# Altium schematic sheet GT_4SBalancer.SchDoc
size A
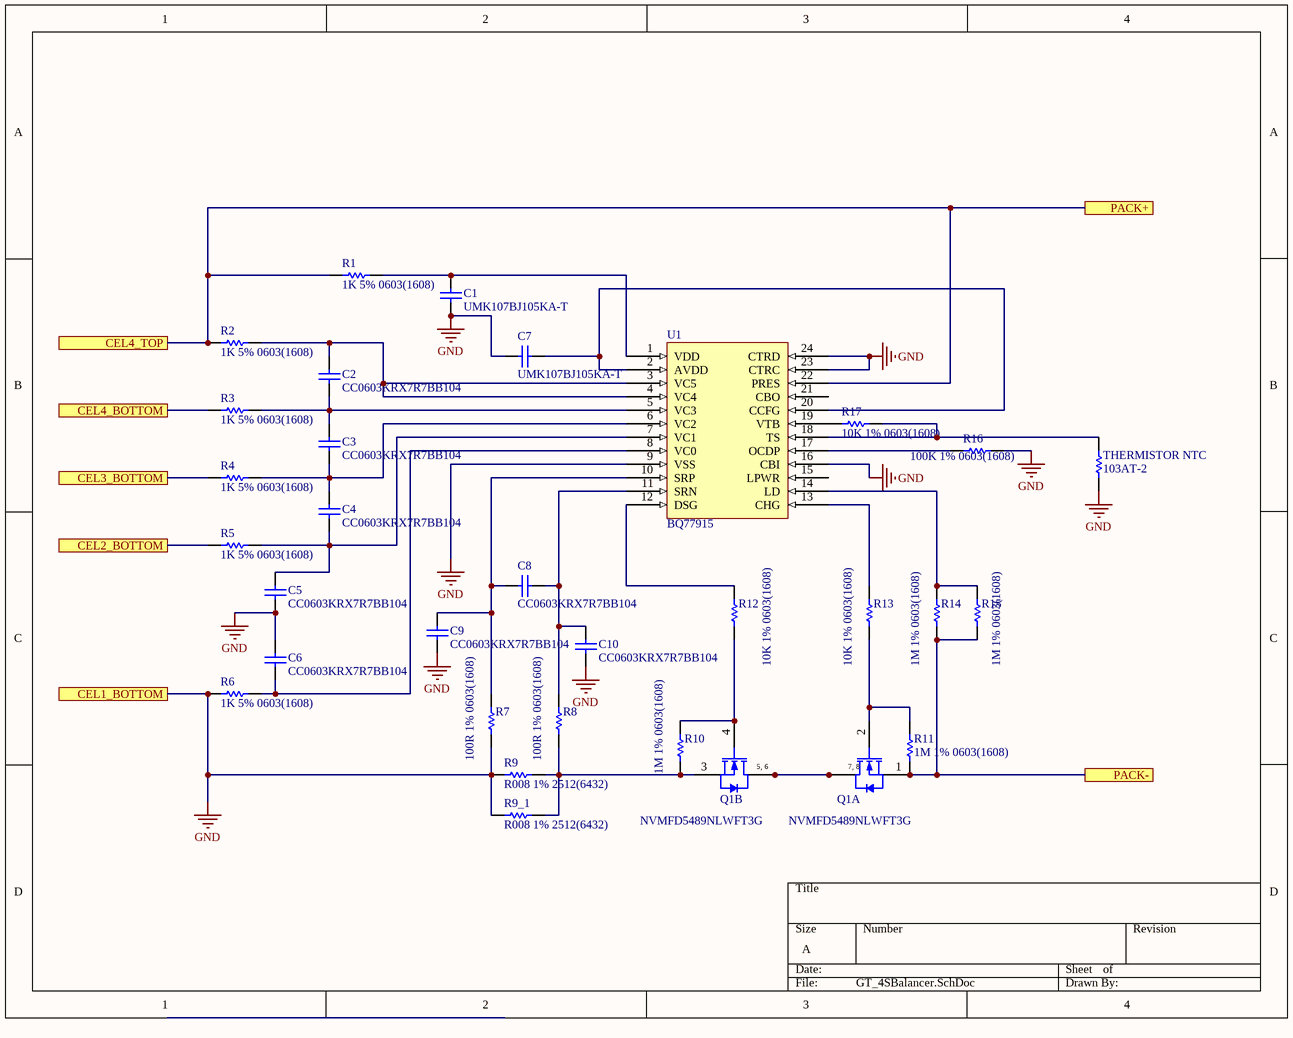
[diagram p0: GT_4SBalancer.SchDoc]

## Parts
C1  UMK107BJ105KA-T  [CAPC1608X90X35ML10T25]
C2  CC0603KRX7R7BB104  [CAPC1608X90X40ML10T20]
C3  CC0603KRX7R7BB104  [CAPC1608X90X40ML10T20]
C4  CC0603KRX7R7BB104  [CAPC1608X90X40ML10T20]
C5  CC0603KRX7R7BB104  [CAPC1608X90X40ML10T20]
C6  CC0603KRX7R7BB104  [CAPC1608X90X40ML10T20]
C7  UMK107BJ105KA-T  [CAPC1608X90X35ML10T25]
C8  CC0603KRX7R7BB104  [CAPC1608X90X40ML10T20]
C9  CC0603KRX7R7BB104  [CAPC1608X90X40ML10T20]
C10  CC0603KRX7R7BB104  [CAPC1608X90X40ML10T20]
Q1  NVMFD5489NLWFT3G  [ONSC-DFN-8-506BT_V]  (parts A,B of 2)
R1  1K 5% 0603(1608)  [RESC0603(1608)_L]
R2  1K 5% 0603(1608)  [RESC0603(1608)_L]
R3  1K 5% 0603(1608)  [RESC0603(1608)_L]
R4  1K 5% 0603(1608)  [RESC0603(1608)_L]
R5  1K 5% 0603(1608)  [RESC0603(1608)_L]
R6  1K 5% 0603(1608)  [RESC0603(1608)_L]
R7  100R 1% 0603(1608)  [RESC0603(1608)_M]
R8  100R 1% 0603(1608)  [RESC0603(1608)_M]
R9  R008 1% 2512(6432)  [RESC2512(6432)_L]
R9_1  R008 1% 2512(6432)  [RESC2512(6432)_L]
R10  1M 1% 0603(1608)  [RESC0603(1608)_L]
R11  1M 1% 0603(1608)  [RESC0603(1608)_L]
R12  10K 1% 0603(1608)  [RESC0603(1608)_N]
R13  10K 1% 0603(1608)  [RESC0603(1608)_N]
R14  1M 1% 0603(1608)  [RESC0603(1608)_L]
R15  1M 1% 0603(1608)  [RESC0603(1608)_L]
R16  100K 1% 0603(1608)  [RESC0603(1608)_N]
R17  10K 1% 0603(1608)  [RESC0603(1608)_N]
THERMISTOR_NTC  103AT-2  [SEMI-103AT-2_V]
U1  BQ77915  [BQ77915]

## Ports
CEL1_BOTTOM, CEL2_BOTTOM, CEL3_BOTTOM, CEL4_BOTTOM, CEL4_TOP, PACK+, PACK-

## Nets
GND: C1.1 C5.1 C6.2 C7.1 C9.1 C10.1 R6.1 R7.1 R9.1 R9_1.1 R16.2 THERMISTOR_NTC.1 U1.9(VSS) U1.16(CBI) U1.23(CTRC) U1.24(CTRD) ; port CEL1_BOTTOM
CEL2_BOTTOM: R5.1 ; port CEL2_BOTTOM
CEL3_BOTTOM: R4.1 ; port CEL3_BOTTOM
CEL4_BOTTOM: R3.1 ; port CEL4_BOTTOM
CEL4_TOP: R1.1 R2.1 U1.22(PRES) ; port CEL4_TOP, port PACK+
PACK-: Q1.1(S1) R11.1 R14.1 R15.1 ; port PACK-
NetC1_2: C1.2 R1.2 U1.1(VDD)
NetC2_1: C2.1 C3.2 R3.2 U1.5(VC3)
NetC2_2: C2.2 R2.2 U1.3(VC5) U1.4(VC4)
NetC3_1: C3.1 C4.2 R4.2 U1.6(VC2)
NetC4_1: C4.1 C5.2 R5.2 U1.7(VC1)
NetC6_1: C6.1 R6.2 U1.8(VC0)
NetC7_2: C7.2 U1.2(AVDD) U1.20(CCFG)
NetC8_1: C8.1 C10.2 R8.2 U1.11(SRN)
NetC8_2: C8.2 C9.2 R7.2 U1.10(SRP)
NetQ1_2: Q1.2(G1) R11.2 R13.1
NetQ1_3: Q1.3(S2) R8.1 R9.2 R9_1.2 R10.1
NetQ1_4: Q1.4(G2) R10.2 R12.1
NetQ1_5: Q1.5(D2) Q1.6(D2) Q1.7(D1) Q1.8(D1)
NetR12_2: R12.2 U1.12(DSG)
NetR13_2: R13.2 U1.13(CHG)
NetR14_2: R14.2 R15.2 U1.14(LD)
NetR16_1: R16.1 U1.17(OCDP)
NetR17_1: R17.1 THERMISTOR_NTC.2 U1.18(TS)
NetR17_2: R17.2 U1.19(VTB)

Not connected (* = marked no-connect by the designer): U1 15(LPWR) 21(CBO)

## Notes on the sheet
- (in symbol CMP-1058-00276-1, part A) 7, 8
- (in symbol CMP-1058-00276-1, part B) 5, 6

## Library data of the parts
C1 C7 = CMP-2000-05447-1: Chip Capacitor, 1 uF, +/- 10%, 50 V, -55 to 85 degC, 0603 (1608 Metric), RoHS, Tape and Reel; Manufacturer: Taiyo Yuden; Other Names: 587-2400-6; Temperature Coefficient: X5R; Online Catalog: MSeries; Catalog Drawings: xMKSeries_0603_0.8; Capacitance: 1µF; Voltage - Rated: 50V; Series: M; Standard Package: 1; Package Description: 2-Pin Surface Mount Device, Body 1.6 x 0.8 mm; Ratings: -; Height - Seated (Max): -; Mounting Type: SurfaceMount,MLCC; Family: CeramicCapacitors; Features: -; Applications: GeneralPurpose; Lead Spacing: -; Packaging: Digi-Reel; Package Reference: 603; Category: Capacitors; Operating Temperature: -55degC~85degC; Datasheet URL: https://datasheet.ciiva.com/15922/336umk107bj105ka-t-15922611.pdf; Package / Case: 0603(1608Metric); Manufacturer URL: http://www.t-yuden.com/; Lead Style: -; Tolerance: ±10%; Datasheet Version: Mar-13
C2-C6 C8-C10 = CMP-2000-05002-1: Ceramic Multilayer Capacitor, 100 nF, +/- 10%, 50 V, -55 to 155 degC, 0603 (1608 Metric), RoHS, Tape and Reel; Manufacturer: Yageo; Online Catalog: CCSeries; Voltage - Rated: 16V; Product Training Modules: MultilayerCeramicCapacitors; Other Names: 311-1088-6; Featured Product: CommodityMultilayerCeramicCapacitors–CCSeries; Capacitance: 0.1µF; Temperature Coefficient: X7R; Height - Seated (Max): -; Operating Temperature: -55degC~125degC; Package / Case: 0603(1608Metric); Datasheet URL: https://datasheet.ciiva.com/11786/0900766b80d84f1d-11786077.pdf; Package Description: 2-Pin Surface Mount Device, Body 1.6 x 0.8 mm; Family: CeramicCapacitors; Packaging: Digi-Reel; Series: CC; Lead Spacing: -; Features: -; Tolerance: ±10%; Lead Style: -; Ratings: -; Manufacturer URL: http://www.yageo.com/; Package Reference: 603; Standard Package: 1; Category: Capacitors; Mounting Type: SurfaceMount,MLCC; Applications: GeneralPurpose; Datasheet Version: Rev. 2, 05/2009
Q1 = CMP-1058-00276-1: Power MOSFET, 60 V, 12 A, 65 mOhm, Dual N-Channel Logic Level, 8-Pin DFN, Pb-Free, Tape and Reel; Manufacturer: On Semiconductor; Channel Polarity: N Channel; VGS(th) Max (V): 2.5; Ciss Typ (pF): 330; V(BR)DSS Min (V): 60; Coss Typ (pF): 80; Crss Typ (pF): 39; ID Max (A): 12; Qrr Typ (nC): 26.5; VGS Max (V): 20; PackageVersion: Rev. E, 02/2013; ComponentLink2Description: Datasheet; ComponentLink1URL: http://www.onsemi.com/; ComponentLink1Description: Manufacturer URL; PartNumber: NVMFD5489NLWFT3G; PackageDescription: 8-Pin Small Outline No-Lead, Body 4.9 x 5.9 mm, Pitch 1.27 mm; Mounting Technology: Surface Mount; DatasheetVersion: Rev. 1; Configuration: Dual; RoHS: Pb-Free; Package Type: DFN-8; ComponentLink3URL: http://www.onsemi.com/pub_link/Collateral/506BT.PDF; ComponentLink3Description: Package Specification; Packing: Tape and Reel; ComponentLink2URL: http://www.onsemi.com/pub_link/Collateral/NVMFD5489NL-D.PDF; PackageReference: DFN-8-506BT; PartId: 1
R1-R6 = CMP-1012-00074-1: 1K 0.1W 5% 0603 (1608 Metric)  SMD; Case-EIA: 0603; Case-Metric: 1608; Value: 1000.00 Ohm; Technology: SMT; Tolerance: 5 %; Power: 0.1 W
R7 R8 = CMP-1012-00397-1: 100R 0.1W 1% 0603 (1608 Metric)  SMD; Value: 100.00 Ohm; Case-EIA: 0603; Case-Metric: 1608; Technology: SMT; Tolerance: 1 %; Power: 0.1 W
R9 R9_1 = CMP-1018-00676-1: 30K1 1W 1% 2512 (6432 Metric)  SMD; Case-Metric: 6432; Value: 30100.00 Ohm; Case-EIA: 2512; Power: 1 W; Tolerance: 1 %; Technology: SMT
R10 R11 R14 R15 = CMP-1012-00849-1: 1M 0.1W 1% 0603 (1608 Metric)  SMD; Value: 1000000.00 Ohm; Case-EIA: 0603; Case-Metric: 1608; Power: 0.1 W; Tolerance: 1 %; Technology: SMT
R12 R13 R17 = CMP-1012-00623-1: 10K 0.1W 1% 0603 (1608 Metric)  SMD; Value: 10000.00 Ohm; Case-EIA: 0603; Case-Metric: 1608; Power: 0.1 W; Tolerance: 1 %; Technology: SMT
R16 = CMP-1012-00736-1: 100K 0.1W 1% 0603 (1608 Metric)  SMD; Value: 100000.00 Ohm; Case-Metric: 1608; Case-EIA: 0603; Power: 0.1 W; Tolerance: 1 %; Technology: SMT
THERMISTOR_NTC = CMP-2000-05824-1: Precision NTC Thermistor, 10 kOhm, +/- 1%, 10 mW, -50 to 110 degC, 2-Pin THD, RoHS, Bulk; Brand: Semitec; Resistance: 10kOhms; Packaging: Bulk; Mounting Technology: ThroughHole; Operating Temperature Range: -50Cto+110C; Lead Spacing: 2.54mm; RoHS: True; Manufacturer URL: http://www.semitec.co.jp/english/; Datasheet Version: Rev. A, 02/2007; Length: 17mm; Manufacturer: Semitec; Termination Style: Radial; Tolerance: 1%; Datasheet URL: https://www.rapidonline.com/pdf/61-0500e.pdf; Product Category: Thermistors-NTC; Series: AT; Package Description: 2-Pin Through Hole Device, Body Width 3.8 mm (Max), Pitch 2.54 mm; Width: 3.7mm; Type: NTC; Package Reference: 103AT-2; Height: 2.4mm